# EAGLE design lra (EAGLE 6.5.0)
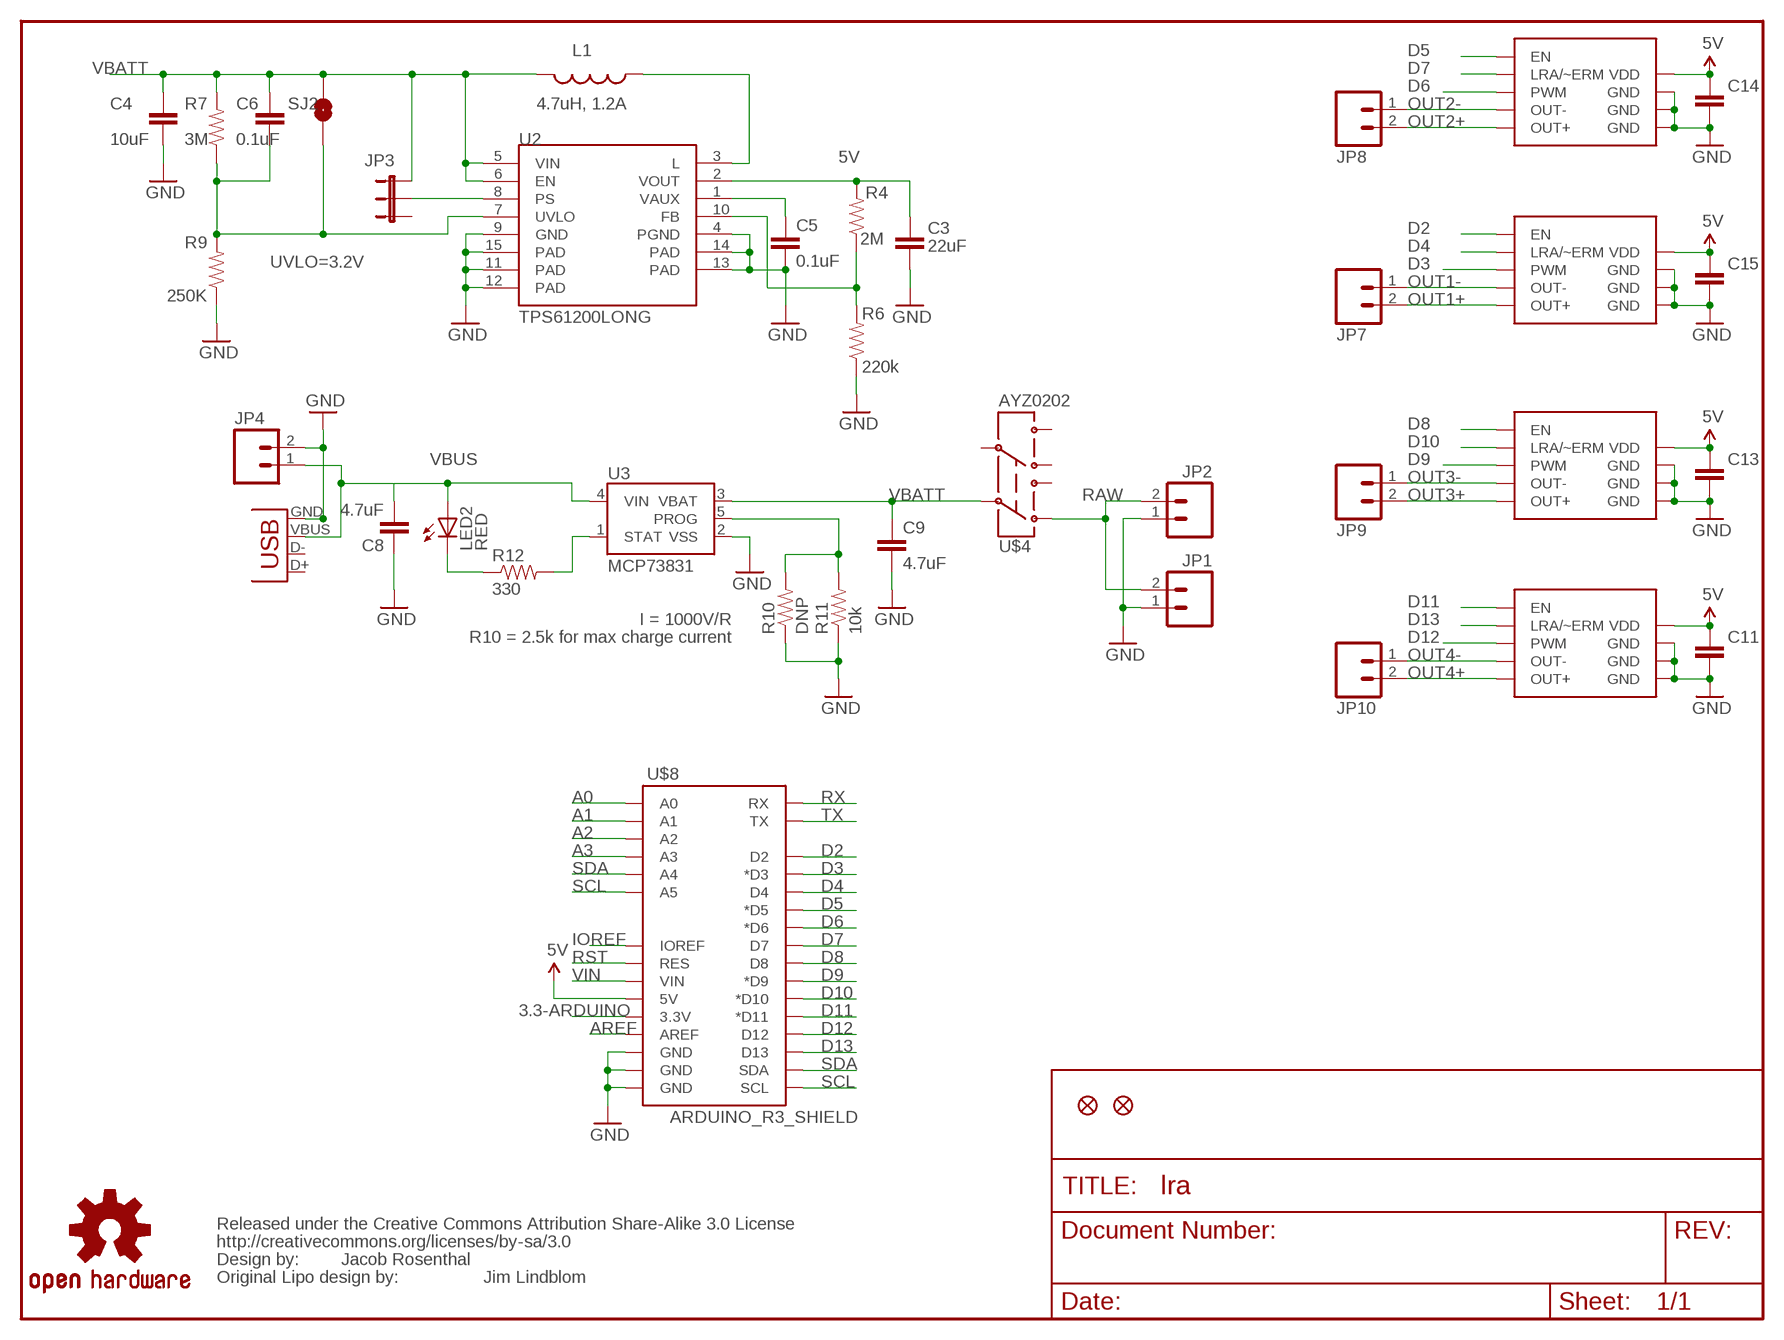
[diagram p0: schematic, sheet 1]

## Parts
$$U$1  CREATIVE_COMMONS  [CREATIVE_COMMONS]
C3  22uF  CAP0805  [0805]
C4  10uF  CAP0805  [0805]
C5  0.1uF  CAP0805  [0805]
C6  0.1uF  CAP0805  [0805]
C8  4.7uF  CAP0805  [0805]
C9  4.7uF  CAP0805  [0805]
C11  CAP0805  [0805]
C13  CAP0805  [0805]
C14  CAP0805  [0805]
C15  CAP0805  [0805]
JP1  M021X02_NO_SILK  [1X02_NO_SILK]
JP2  M02-JST-2MM-SMT  [JST-2-SMD]
JP3  JUMPER-32-3  [SJ_3_PASTE2&3]
JP4  M021X02_NO_SILK  [1X02_NO_SILK]
JP5  FIDUCIAL1X2.5  [FIDUCIAL-1X2.5]
JP6  FIDUCIAL1X2.5  [FIDUCIAL-1X2.5]
JP7  M02PTH3  [1X02_LONGPADS]
JP8  M02PTH3  [1X02_LONGPADS]
JP9  M02PTH3  [1X02_LONGPADS]
JP10  M02PTH3  [1X02_LONGPADS]
L1  4.7uH, 1.2A  INDUCTOR.  [CDRH2D09]
LED2  RED  LEDCHIP-LED0805  [CHIP-LED0805]
R4  2M  RESISTOR0805-RES  [0805]
R6  220k  RESISTOR0805-RES  [0805]
R7  3M  RESISTOR0805-RES  [0805]
R9  250K  RESISTOR0805-RES  [0805]
R10  DNP  RESISTOR0805-RES  [0805]
R11  10k  RESISTOR0805-RES  [0805]
R12  330  RESISTOR0805-RES  [0805]
SJ2  Power Saving Off  SOLDERJUMPERNO  [SJ_2S-NO]
U2  TPS61200LONG  [QFN-10_PAD_LONG]
U3  MCP73831  [SOT23-5]
U$2  DRV260310WFQFN  [10WFQFN]
U$3  DRV260310WFQFN  [10WFQFN]
U$4  AYZ0202  [AYZ0202]
U$6  DRV260310WFQFN  [10WFQFN]
U$7  DRV2603  [10WFQFN-LONG]
U$8  ARDUINO_R3_SHIELD  [UNO_R3_SHIELD]
U$100  OSHW-LOGOM  [OSHW-LOGO-M]
X1  USBSMD  [USB-MINIB]

## Nets
3.3-ARDUINO: U$8.3.3V
5V: C3.1 C11.1 C13.1 C14.1 C15.1 R4.2 U2.2(VOUT) U$2.P$7(VDD) U$3.P$7(VDD) U$6.P$7(VDD) U$7.P$7(VDD) U$8.5V
A0: U$8.A0
A1: U$8.A1
A2: U$8.A2
A3: U$8.A3
AREF: U$8.AREF
D2: U$3.P$1(EN) U$8.D2
D3: U$3.P$2(PWM) U$8.D3(*D3)
D4: U$3.P$3(LRA/~ERM) U$8.D4
D5: U$2.P$1(EN) U$8.D5(*D5)
D6: U$2.P$2(PWM) U$8.D6(*D6)
D7: U$2.P$3(LRA/~ERM) U$8.D7
D8: U$6.P$1(EN) U$8.D8
D9: U$6.P$2(PWM) U$8.D9(*D9)
D10: U$6.P$3(LRA/~ERM) U$8.D10(*D10)
D11: U$7.P$1(EN) U$8.D11(*D11)
D12: U$7.P$2(PWM) U$8.D12
D13: U$7.P$3(LRA/~ERM) U$8.D13
FB: R4.1 R6.2 U2.10(FB)
GND: C3.2 C4.2 C5.2 C8.1 C9.2 C11.2 C13.2 C14.2 C15.2 JP1.1 JP2.1 JP4.2 R6.1 R9.1 R10.1 R11.1 U2.4(PGND) U2.9(GND) U2.11(PAD) U2.12(PAD) U2.13(PAD) U2.14(PAD) U2.15(PAD) U3.2(VSS) U$2.GND@1(GND) U$2.GND@2(GND) U$2.GND@3(GND) U$3.GND@1(GND) U$3.GND@2(GND) U$3.GND@3(GND) U$6.GND@1(GND) U$6.GND@2(GND) U$6.GND@3(GND) U$7.GND@1(GND) U$7.GND@2(GND) U$7.GND@3(GND) U$8.GND@0(GND) U$8.GND@1(GND) U$8.GND@2(GND) X1.GND
IOREF: U$8.IOREF
N$3: L1.P$1 U2.3(L)
N$4: C5.1 U2.1(VAUX)
N$5: LED2.C R12.1
OUT1+: JP7.2 U$3.P$9(OUT+)
OUT1-: JP7.1 U$3.P$6(OUT-)
OUT2+: JP8.2 U$2.P$9(OUT+)
OUT2-: JP8.1 U$2.P$6(OUT-)
OUT3+: JP9.2 U$6.P$9(OUT+)
OUT3-: JP9.1 U$6.P$6(OUT-)
OUT4+: JP10.2 U$7.P$9(OUT+)
OUT4-: JP10.1 U$7.P$6(OUT-)
PROG: R10.2 R11.2 U3.5(PROG)
PS: JP3.2 U2.8(PS)
RAW: JP1.2 JP2.2 U$4.3
RST: U$8.RES
RX: U$8.RX
SCL: U$8.A5 U$8.SCL
SDA: U$8.A4 U$8.SDA
STAT: R12.2 U3.1(STAT)
TX: U$8.TX
UVLO: C6.2 R7.1 R9.2 SJ2.1 U2.7(UVLO)
VBATT: C4.1 C6.1 C9.1 JP3.3 L1.P$2 R7.2 SJ2.2 U2.5(VIN) U2.6(EN) U3.3(VBAT) U$4.2
VBUS: C8.2 JP4.1 LED2.A U3.4(VIN) X1.VBUS
VIN: U$8.VIN
Unconnected: JP3.1 U$4.1 U$4.4 U$4.5 U$4.6 X1.D+ X1.D-

## Notes on the sheet
- UVLO=3.2V
- I = 1000V/R
- R10 = 2.5k for max charge current
- Jacob Rosenthal
- Original Lipo design by: | Jim Lindblom

## Library data of the parts
$$U$1 = SparkFun:CREATIVE_COMMONS
C3-C6 C8 C9 = SparkFun:CAP: Capacitor Standard 0603 ceramic capacitor, and 0.1" leaded capacitor.
C11 C13-C15 = CH_passive:CAP: Capacitor Standard 0603 ceramic capacitor, and 0.1" leaded capacitor.
JP1 JP2 JP4 JP7-JP10 = SparkFun:M02: Header 2 Standard 2-pin 0.1" header. Use with straight break away headers (SKU : PRT-00116), right angle break away headers (PRT-00553), swiss pins (PRT-00743), machine pins (PRT-00117), and female headers (PRT-00115). Molex polarized connector foot print use with SKU : PRT-08233 with associated crimp pins and housings.
JP3 = SparkFun:JUMPER-3
JP5 JP6 = abes:FIDUCIAL: Fiducial Alignment Points Various fiducial points for machine vision alignment.
L1 = SparkFun:INDUCTOR: Inductors Basic Inductor/Choke - 0603 and 1206. Footprints are not proven and vary greatly between part numbers.
LED2 = led:LED: LED OSRAM: - CHIPLED LG R971, LG N971, LY N971, LG Q971, LY Q971, LO R971, LY R971 LH N974, LH R974 LS Q976, LO Q976, LY Q976 LO Q996 - Hyper CHIPLED LW Q18S LB Q993, LB Q99A, LB R99A - SideLED LS A670, LO A670, LY A670, LG A670, LP A670 LB A673, LV A673, LT A673, LW A673 LH A674 LY A675 LS A676, LA A676, LO A676, LY A676, LW A676 LS A679, LY A679, LG A679 - Hyper Micro SIDELED® LS Y876, LA Y876, LO Y876, LY Y876 LT Y87S - SmartLED LW L88C, LW L88S LB L89C, LB L89S, LG L890 LS L89K, LO L89K, LY L89K LS L896, LA L896, LO L896, LY L896 - TOPLED LS T670, LO T670, LY T670, LG T670, LP T670 LSG T670, LSP T670, LSY T670, LOP T670, LYG T670 LG T671, LOG T671, LSG T671 LB T673, LV T673, LT T673, LW T673 LH T674 LS T676, LA T676, LO T676, LY T676, LB T676, LH T676, LSB T676, LW T676 LB T67C, LV T67C, LT T67C, LS T67K, LO T67K, LY T67K, LW E67C LS E67B, LA E67B, LO E67B, LY E67B, LB E67C, LV E67C, LT E67C LW T67C LS T679, LY T679, LG T679 LS T770, LO T770, LY T770, LG T770, LP T770 LB T773, LV T773, LT T773, LW T773 LH T774 LS E675, LA E675, LY E675, LS T675 LS T776, LA T776, LO T776, LY T776, LB T776 LHGB T686 LT T68C, LB T68C - Hyper Mini TOPLED® LB M676 - Mini TOPLED Santana® LG M470 LS M47K, LO M47K, LY M47K Source: http://www.osram.convergy.de LUXEON: - LUMILED® LXK2-PW12-R00, LXK2-PW12-S00, LXK2-PW14-U00, LXK2-PW14-V00 LXK2-PM12-R00, LXK2-PM12-S00, LXK2-PM14-U00 LXK2-PE12-Q00, LXK2-PE12-R00, LXK2-PE12-S00, LXK2-PE14-T00, LXK2-PE14-U00 LXK2-PB12-K00, LXK2-PB12-L00, LXK2-PB12-M00, LXK2-PB14-N00, LXK2-PB14-P00, LXK2-PB14-Q00 LXK2-PR12-L00, LXK2-PR12-M00, LXK2-PR14-Q00, LXK2-PR14-R00 LXK2-PD12-Q00, LXK2-PD12-R00, LXK2-PD12-S00 LXK2-PH12-R00, LXK2-PH12-S00 LXK2-PL12-P00, LXK2-PL12-Q00, LXK2-PL12-R00 Source: www.luxeon.com KINGBRIGHT: KA-3528ASYC Source: www.kingbright.com
R4 R6 R7 R9-R12 = SparkFun:RESISTOR: Resistor Basic schematic elements and footprints for 0603, 1206, and PTH resistors.
SJ2 = SparkFun:SOLDERJUMPER: Solder Jumper Standard SMD solder jumper. Used to automate production. Two varients : Normally Open and Normally Closed are the same, but have different paste layers. NC will have a large amount of paste and should jumper during reflow.
U2 = jjr:TPS61200: DC to DC Booster IC-10035
U3 = SparkFun:MCP73831: Microchip's MCP73831 Miniature single cell, fully integrated Li-Ion, Li-polymer charge management controller http://ww1.microchip.com/downloads/en/DeviceDoc/21984a.pdf
U$2 U$3 U$6 U$7 = jjr:DRV2603: DRV2603 Long pads for hand soldering
U$4 = SparkFun:AYZ0202: SPDT Slide Switch Simple SMD single-pull double-throw slide switch. Good for less than 350mA power switch, switching UARTs between devices, etc. Spark Fun Electronics SKU : COM-00597
U$8 = SparkFun-Boards:ARDUINO_R3_SHIELD: Shield form compatible with the Arduino Uno R3.
U$100 = SparkFun:OSHW-LOGO: Open Source Hardware Logo This logo indicates the piece of hardware it is found on incorporates a OSHW license and/or adheres to the definition of open source hardware found here: http://freedomdefined.org/OSHW
X1 = SparkFun:USB: USB Connectors USB-B-PTH is fully proven SKU : PRT-00139 USB-miniB is fully proven SKU : PRT-00587 USB-A-PCB is untested. USB-A-H is throughly reviewed, but untested. Spark Fun Electronics SKU : PRT-00437 USB-B-SMT is throughly reviewed, but untested. Needs silkscreen touching up. USB-A-S has not been used/tested USB-MB-H has not been used/tested

## Net classes
0 default: width 0.152 mm

## Board
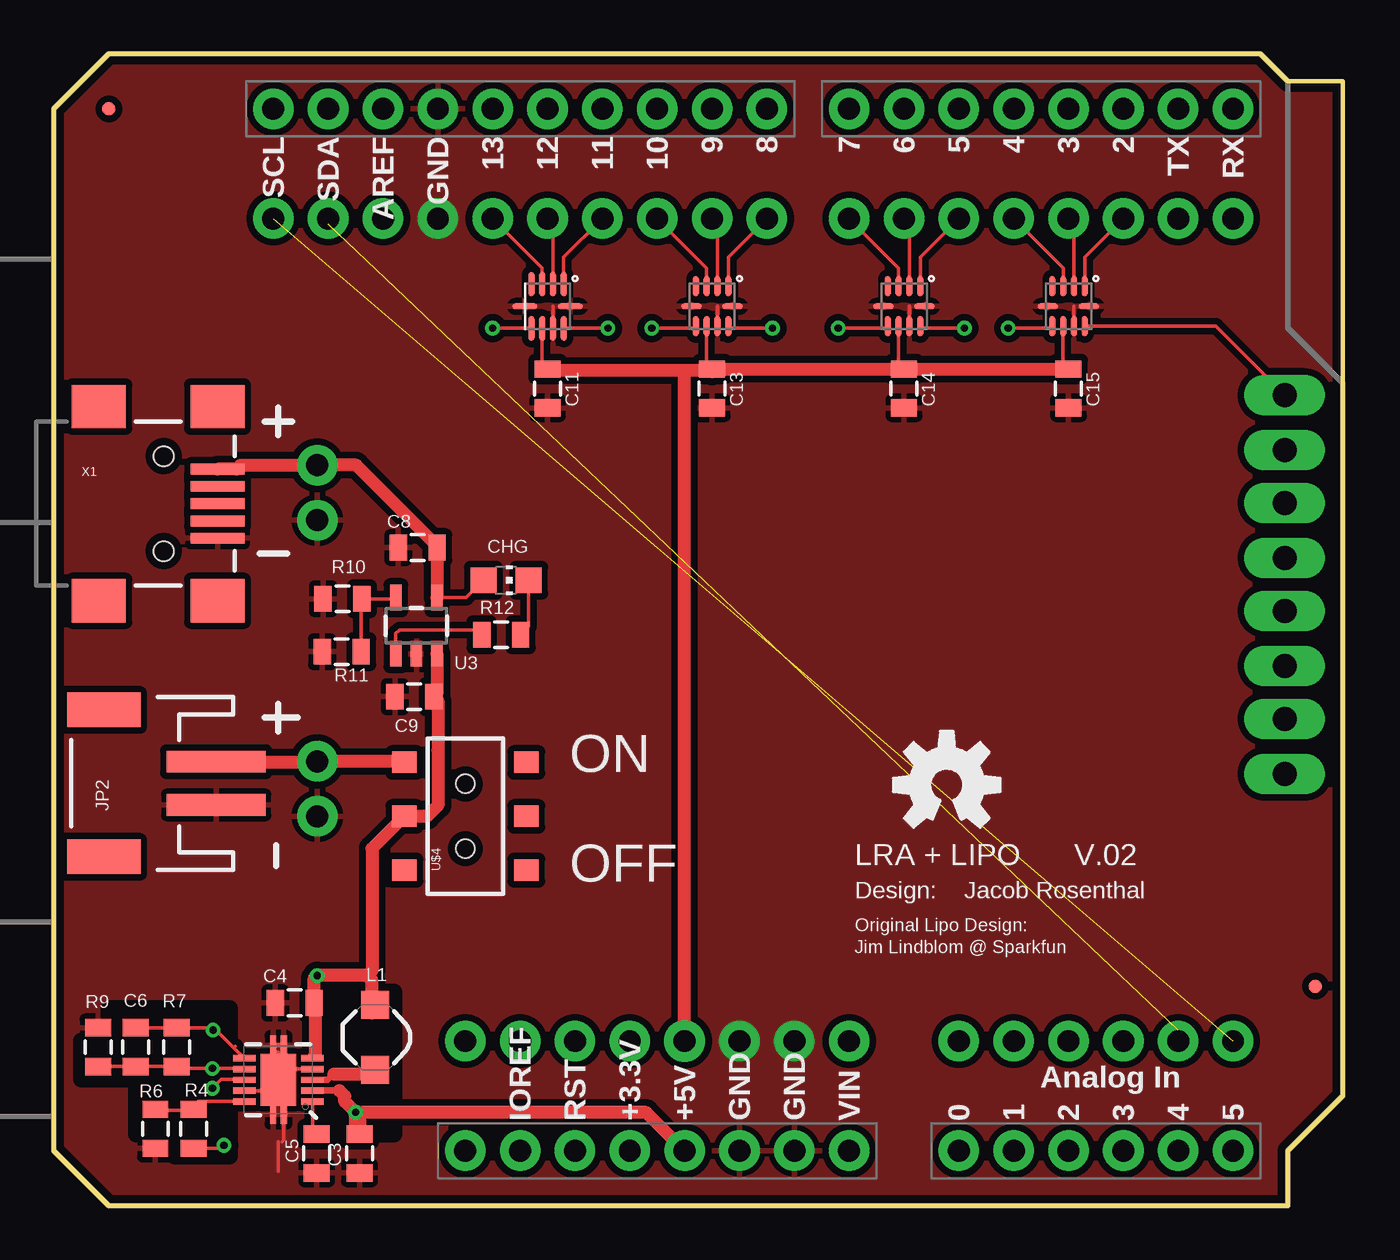
[diagram p1: board, top side]
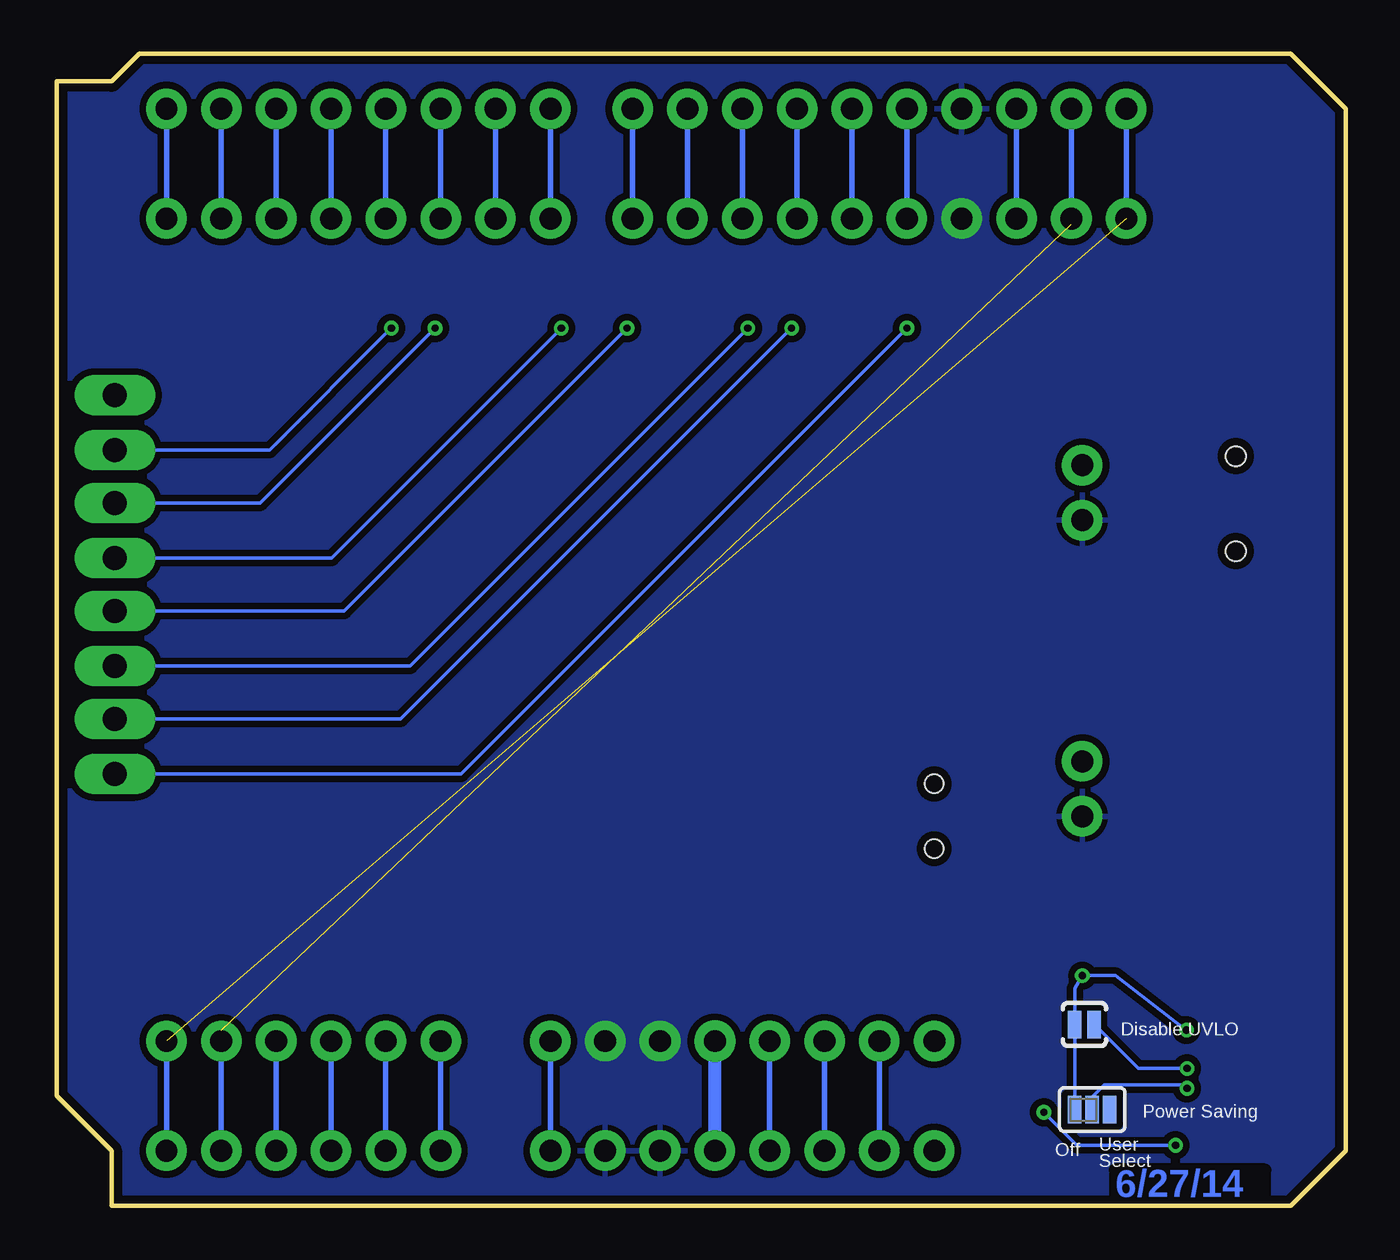
[diagram p2: board, bottom side, seen from below]

Size 59.69 x 53.34 mm. Coordinates in mm from the lower left corner, seen from the top.
Outline: 0,2.54 0,50.8 2.54,53.34 55.88,53.34 57.15,52.07 59.69,52.07 59.69,5.08 57.15,2.54 57.15,0 2.54,0 0,2.54
Copper layers (1*16): Top 0.0356mm / dielectric 1.5011mm / Bottom 0.0356mm
Design rules "LaenPCBOrder": minimum track width 6mil, minimum drill 13mil, track to track 6mil, track to pad 6mil, pad to pad 6mil, via to via 6mil, smd to smd 6mil, copper to edge 15mil, drill to drill 6mil, minimum pad ring 7mil, minimum via ring 7mil, stop-mask expansion 4mil, vias tented up to drill 0mil, thermal gap 10mil
tRestrict: area 13,3.3 to 15.7,9.9; area 1.3,2.3 to 8.1,9.1

### Footprints (pad centres in the part's own frame; a part is rotated, then mirrored left to right if it is on the bottom)
0805 = smd 0.8 x 1.2: 1 -0.9,0; 2 0.9,0
1X02_NO_SILK = drill 1.016 pad 1.88: 1 0,0; 2 2.54,0
JST-2-SMD = smd 1 x 4.6: 1 -1,-3.7; 2 1,-3.7 | smd 1.6 x 3.4: NC1 -3.4,1.5; NC2 3.4,1.5
SJ_3_PASTE2&3 = smd 0.635 x 1.27: 1 -0.813,0; 2 0,0; 3 0.813,0
FIDUCIAL-1X2.5 = smd 0.635 x 0.635: 1 0,0
1X02_LONGPADS = drill 1.118 pad 1.88 long: 1 0,0; 2 2.54,0
CDRH2D09 = smd 1.3 x 1.3: P$1 -1.5,0; P$2 1.5,0
CHIP-LED0805 = smd 1.2 x 1.2: A 0,-1.05; C 0,1.05
SJ_2S-NO = smd 0.635 x 1.27: 1 -0.45,0; 2 0.45,0
QFN-10_PAD_LONG = smd 0.297 x 1.05: 1 -1,-1.575; 2 -0.5,-1.575; 3 0,-1.575; 4 0.5,-1.575; 5 1,-1.575; 6 1,1.575; 7 0.5,1.575; 8 0,1.575; 9 -0.5,1.575; 10 -1,1.575 | smd 0.9 x 0.28: 11 -1.6,0.25; 12 -1.6,-0.25; 13 1.6,0.25; 14 1.6,-0.25 | smd 2.4 x 1.65: 15 0,0
SOT23-5 = smd 0.55 x 1.2: 1 -0.95,-1.3; 2 0,-1.3; 3 0.95,-1.3; 4 0.95,1.3; 5 -0.95,1.3
10WFQFN = smd 0.95 x 0.28: GND@1 -0.95,0; GND@2 0.95,0 | smd 0.28 x 0.95: GND@3 -0.25,0.925; P$1 -0.75,-0.925; P$2 -0.25,-0.925; P$3 0.25,-0.925; P$4 0.75,-0.925; P$6 0.75,0.925; P$7 0.25,0.925; P$9 -0.75,0.925
AYZ0202 = smd 1 x 1.15: 1 -2.5,2.825; 2 0,2.825; 3 2.5,2.825; 4 -2.5,-2.825; 5 0,-2.825; 6 2.5,-2.825 | hole 0.85: 1.5,0; -1.5,0
10WFQFN-LONG = smd 1.15 x 0.28: GND@1 -1.05,0; GND@2 1.05,0 | smd 0.28 x 1.15: GND@3 -0.25,1.025; P$1 -0.75,-1.025; P$2 -0.25,-1.025; P$3 0.25,-1.025; P$4 0.75,-1.025; P$6 0.75,1.025; P$7 0.25,1.025; P$9 -0.75,1.025
UNO_R3_SHIELD = drill 1.016 pad 1.88: 3.3V 50.8,26.67; 5V 50.8,29.21; A0 50.8,41.91; A1 50.8,44.45; A2 50.8,46.99; A3 50.8,49.53; A4 50.8,52.07; A5 50.8,54.61; AREF 2.54,15.24; D2 2.54,49.53; D3 2.54,46.99; D4 2.54,44.45; D5 2.54,41.91; D6 2.54,39.37; D7 2.54,36.83; D8 2.54,33.02; D9 2.54,30.48; D10 2.54,27.94; D11 2.54,25.4; D12 2.54,22.86; D13 2.54,20.32; GND@0 50.8,31.75; GND@1 50.8,34.29; GND@2 2.54,17.78; IOREF 50.8,21.59; NC 50.8,19.05; RES 50.8,24.13; RX 2.54,54.61; SCL 2.54,10.16; SDA 2.54,12.7; TX 2.54,52.07; VIN 50.8,36.83
USB-MINIB = smd 2.5 x 0.5: D+ 2.5,0; D- 2.5,0.8; GND 2.5,-1.6; ID 2.5,-0.8; VBUS 2.5,1.6 | smd 2.5 x 2: MTN1 -3,4.5; MTN2 2.5,4.5; MTN3 -3,-4.5; MTN4 2.5,-4.5 | hole 0.9: 0,2.2; 0,-2.2

### Placement (x,y rotation side)
$$U$1  -11.43,-11.43 0 top  (outside the outline)
C3  14.15,2.41 270 top
C4  11.15,9.39 180 top
C5  12.17,2.41 270 top
C6  3.79,7.34 270 top
C8  16.85,30.48 0 top
C9  16.69,23.57 180 top
C11  22.86,37.85 270 top
C13  30.48,37.85 270 top
C14  39.37,37.85 270 top
C15  46.99,37.85 270 top
JP1  12.19,18.03 90 top
JP2  3.81,19.56 90 top
JP3  11.73,4.45 180 bottom
JP4  12.19,34.29 270 top
JP5  2.54,50.8 0 top
JP6  58.42,10.16 0 top
JP7  57,35 90 top
JP8  57,30 90 top
JP9  57,25 90 top
JP10  57,20 90 top
L1  14.86,7.79 90 top
LED2  20.94,28.96 270 top
R4  6.48,3.56 270 top
R6  4.7,3.56 90 top
R7  5.67,7.34 90 top
R9  2.04,7.34 270 top
R10  13.36,28.11 0 top
R11  13.33,25.65 0 top
R12  20.71,26.44 180 top
SJ2  12.09,8.39 180 bottom
U2  10.4,5.83 90 top
U3  16.78,26.86 0 top
U$2  39.37,41.66 180 top
U$3  46.99,41.66 180 top
U$4  19.05,18.03 90 top
U$6  30.48,41.66 180 top
U$7  22.86,41.66 180 top
U$8  0,53.34 270 top
U$100  41.35,19.48 0 top
X1  5.08,32.51 0 top

### Tracks (layer width: path | path; a pad name or v marks a point on that pad's centre or on a via)
3.3-ARDUINO  (via drill 1.02 pad 1.88)
  Bottom 0.254: v26.67,7.62 U$8.3.3V
5V  (via drill 0.33, 1.02 pad 1.91)
  Top 0.152: U$3.P$7 46.74,40.64 46.74,38.86 46.99,38.61 C15.1 46.85,38.61 | C13.1 30.48,38.61 30.23,38.86 30.23,40.64 U$6.P$7 | U$7.P$7 22.61,39 C11.1 | U$2.P$7 39.12,39 C14.1 39.51,38.75 | v7.87,2.79 7.74,2.66 R4.2
  Top 0.305: U2.2 13.21,5.33
  Top 0.61: C14.1 30.62,38.75 30.48,38.61 30.4,38.68 29.21,38.68 | 39.51,38.75 C15.1 | 30.39,38.66 C13.1 | C11.1 22.92,38.68 29.21,38.68 | v29.21,7.62 29.21,38.68 | U$8.5V 27.43,4.32 14.22,4.32 14.15,4.24 C3.1 13.97,3.49 v13.97,4.32 13.46,4.83 13.46,5.08 13.21,5.33
  Bottom 0.152: v13.97,4.32 12.45,2.79 v7.87,2.79
  Bottom 0.61: U$8.5V v29.21,7.62
A0  (via drill 1.02 pad 1.88)
  Bottom 0.254: v41.91,7.62 U$8.A0
A1  (via drill 1.02 pad 1.88)
  Bottom 0.254: v44.45,7.62 U$8.A1
A2  (via drill 1.02 pad 1.88)
  Bottom 0.254: v46.99,7.62 U$8.A2
A3  (via drill 1.02 pad 1.88)
  Bottom 0.254: v49.53,7.62 U$8.A3
AREF  (via drill 1.02 pad 1.88)
  Bottom 0.254: U$8.AREF v15.24,45.72
D2  (via drill 1.02 pad 1.88)
  Top 0.152: 49.28,45.47 v49.53,45.72 47.74,43.93 U$3.P$1
  Bottom 0.254: U$8.D2 v49.53,45.72
D3  (via drill 1.02 pad 1.88)
  Top 0.152: U$3.P$2 47.24,45.47 v46.99,45.72
  Bottom 0.254: U$8.D3 v46.99,45.72
D4  (via drill 1.02 pad 1.88)
  Top 0.152: U$3.P$3 46.74,43.43 v44.45,45.72
  Bottom 0.254: U$8.D4 v44.45,45.72
D5  (via drill 1.02 pad 1.88)
  Top 0.152: U$2.P$1 40.12,43.93 v41.91,45.72
  Bottom 0.254: U$8.D5 v41.91,45.72
D6  (via drill 1.02 pad 1.88)
  Top 0.152: U$2.P$2 39.62,45.47 v39.37,45.72
  Bottom 0.254: U$8.D6 v39.37,45.72
D7  (via drill 1.02 pad 1.88)
  Top 0.152: U$2.P$3 39.12,43.43 v36.83,45.72
  Bottom 0.254: U$8.D7 v36.83,45.72
D8  (via drill 1.02 pad 1.88)
  Top 0.152: U$6.P$1 31.23,43.93 v33.02,45.72
  Bottom 0.254: U$8.D8 v33.02,45.72
D9  (via drill 1.02 pad 1.88)
  Top 0.152: U$6.P$2 30.73,45.47 v30.48,45.72
  Bottom 0.254: U$8.D9 v30.48,45.72
D10  (via drill 1.02 pad 1.88)
  Top 0.152: U$6.P$3 30.23,43.43 v27.94,45.72
  Bottom 0.254: U$8.D10 v27.94,45.72
D11  (via drill 1.02 pad 1.88)
  Top 0.152: U$7.P$1 23.61,43.93 v25.4,45.72
  Bottom 0.254: U$8.D11 v25.4,45.72
D12  (via drill 1.02 pad 1.88)
  Top 0.152: U$7.P$2 23.11,45.47 v22.86,45.72
  Bottom 0.254: U$8.D12 v22.86,45.72
D13  (via drill 1.02 pad 1.88)
  Top 0.152: U$7.P$3 22.61,43.43 v20.32,45.72
  Bottom 0.254: U$8.D13 v20.32,45.72
FB
  Top 0.152: U2.10 6.67,4.83 R4.1 6.43,4.41 4.72,4.41 R6.2
GND  (via drill 1.02 pad 1.88)
  Top 0.152: U2.15 10.4,6.08 | U2.4 11.67,6.33 10.4,6.33 U2.15 | U2.15 10.4,7.1 10.14,7.1 U2.13 | U2.15 9.64,6.08 | 23.11,41.66 23.11,40.89 U$7.GND@3 | 30.73,41.66 30.73,40.89 U$6.GND@3 | 39.62,41.66 39.62,40.89 U$2.GND@3 | 47.24,41.66 47.24,40.89 U$3.GND@3 | 10.57,2.96 10.65,3.04 U2.12 10.65,4.47 10.26,5.33 | 10.26,5.33 10.84,5.39 U2.15 | 10.39,1.6 10.39,2.96 | U2.9 10.26,5.33
  Top 0.254: U2.14 10.23,7.45
  other vias: 17.78,45.72 31.75,7.62 34.29,7.62
  pour Bottom (isolate 0.305): 0,0 0,53.34 59.69,53.34 59.69,0
  pour Top (isolate 0.305): 0,0 0,53.34 59.69,53.34 59.69,0
IOREF  (via drill 1.02 pad 1.88)
  Bottom 0.254: v21.59,7.62 U$8.IOREF
N$3
  Top 0.305: U2.3 11.98,5.82 12.68,5.82 12.95,6.1
  Top 0.61: 12.95,6.1 14.67,6.1 L1.P$1
N$4
  Top 0.152: 12.2,4.83 U2.1 11.97,3.51 C5.1
N$5
  Top 0.152: LED2.C 21.99,26.82 R12.1
N$12  (via drill 1.02 pad 1.88)
  other vias: 19.05,7.62
OUT1+
  Top 0.152: 47.75,40.64 U$3.P$9 53.81,40.73 JP7.2
OUT1-  (via drill 0.33)
  Top 0.152: v44.2,40.64 46.23,40.64 U$3.P$6
  Bottom 0.152: JP7.1 49.84,35 v44.2,40.64
OUT2+  (via drill 0.33)
  Top 0.152: v42.16,40.64 40.13,40.64 U$2.P$9
  Bottom 0.152: JP8.2 50.26,32.54 v42.16,40.64
OUT2-  (via drill 0.33)
  Top 0.152: v36.32,40.64 38.61,40.64 U$2.P$6
  Bottom 0.152: JP8.1 46.96,30 v36.32,40.64
OUT3+  (via drill 0.33)
  Top 0.152: v33.27,40.64 31.24,40.64 U$6.P$9
  Bottom 0.152: JP9.2 46.37,27.54 v33.27,40.64
OUT3-  (via drill 0.33)
  Top 0.152: v27.69,40.64 29.72,40.64 U$6.P$6
  Bottom 0.152: JP9.1 43.33,25 v27.69,40.64
OUT4+  (via drill 0.33)
  Top 0.152: v25.65,40.64 23.62,40.64 U$7.P$9
  Bottom 0.152: JP10.2 43.75,22.54 v25.65,40.64
OUT4-  (via drill 0.33)
  Top 0.152: 22.1,40.64 U$7.P$6 v20.32,40.64
  Bottom 0.152: JP10.1 40.96,20 v20.32,40.64
PROG
  Top 0.152: R11.2 14.23,28.07 R10.2 15.78,28.11 U3.5
PS  (via drill 0.33)
  Top 0.152: U2.8 8.81,5.84 7.75,5.84 v7.34,5.44
  Bottom 0.152: v7.34,5.44 7.49,5.59 11.18,5.59 11.73,5.03 JP3.2
RAW
  Top 0.61: JP2.2 12.18,20.56 JP1.2 16.18,20.57 U$4.3
RST  (via drill 1.02 pad 1.88)
  Bottom 0.254: v24.13,7.62 U$8.RES
RX  (via drill 1.02 pad 1.88)
  Bottom 0.254: U$8.RX v54.61,45.72
SCL  (via drill 1.02 pad 1.88)  (1 unrouted)
  Bottom 0.254: v54.61,7.62 U$8.A5 | U$8.SCL v10.16,45.72
SDA  (via drill 1.02 pad 1.88)  (1 unrouted)
  Bottom 0.152: 52.07,8.13 v52.07,7.62 | v12.7,45.72 12.7,45.47
  Bottom 0.254: v52.07,7.62 U$8.A4 | U$8.SDA v12.7,45.72
STAT
  Top 0.152: U3.1 15.83,26.5 16,26.67 19.58,26.67 R12.2
TX  (via drill 1.02 pad 1.88)
  Bottom 0.254: U$8.TX v52.07,45.72
UVLO  (via drill 0.33)
  Top 0.152: R9.2 C6.2 R7.1 6.27,6.35 v7.34,6.35 8.8,6.35 U2.7
  Bottom 0.152: SJ2.1 9.6,6.35 v7.34,6.35
VBATT  (via drill 0.33)
  Top 0.152: 12.09,6.94 U2.5 12.19,6.86 12.09,6.99 | 11.93,6.85 12.09,7.01 | C6.1 R7.2 7.25,8.24 v7.37,8.13 7.52,8.13 8.33,7.32 | U2.6 8.33,7.32 | 8.38,7.37 8.33,7.32
  Top 0.305: 12.09,6.99 11.93,6.85 11.98,6.84
  Top 0.406: 11.97,9.18 C4.1
  Top 0.61: 11.97,9.18 12.09,9.18 12.09,6.99 | U3.3 17.73,23.71 C9.1 17.78,23.38 17.78,21.59 17.78,21.08 17.78,18.54 17.27,18.03 U$4.2 14.73,16.54 14.73,10.89 14.49,10.65 | C4.1 12.05,10.53 v12.19,10.65 14.49,10.65 | 14.49,10.65 14.73,10.41 14.73,8.92 14.87,9.05 L1.P$2
  Bottom 0.152: JP3.3 SJ2.2 12.54,10.06 v12.19,10.65 12.19,10.67 10.67,10.67 v7.37,8.13
VBUS
  Top 0.152: U3.4 19.09,28.16 LED2.A
  Top 0.61: U3.4 17.75,28.17 C8.2 17.78,30.51 14,34.29 JP4.1 | X1.VBUS 8.46,34.11 8.64,34.29 JP4.1 | JP4.1 11.68,34.29
VIN  (via drill 1.02 pad 1.88)
  Bottom 0.254: v36.83,7.62 U$8.VIN

### Text on the board
Bottom: 6/27/14
tPlace: CHG | LRA + LIPO | V.02 | Design: | Jacob Rosenthal | Original Lipo Design: | Jim Lindblom @ Sparkfun
bPlace: Disable UVLO | Power Saving | User | Select | Off
tNames: ON | OFF
tDocu: Jacob Rosenthal | Original Lipo Design: | Jim Lindblom @ Sparkfun